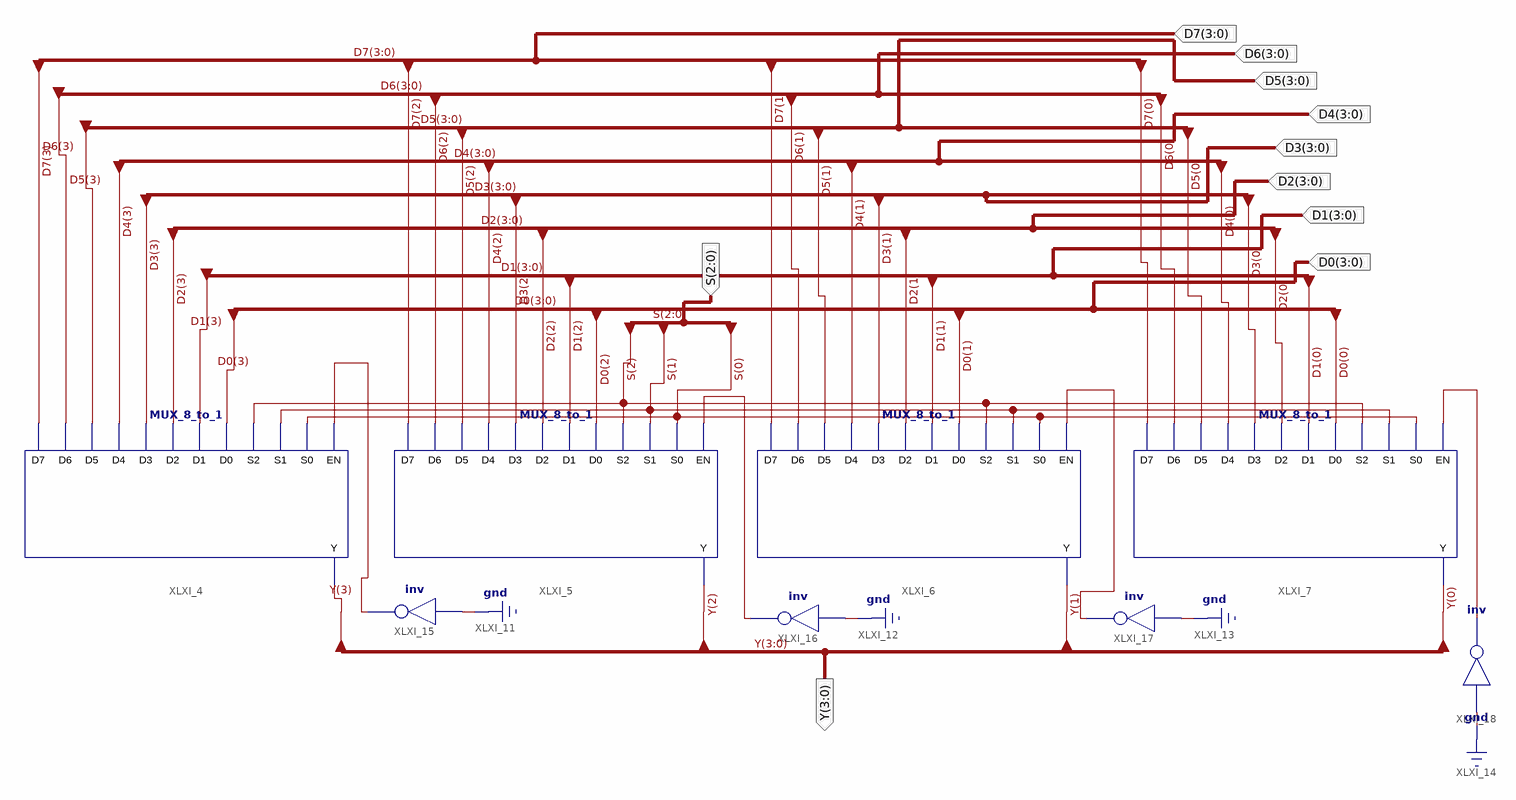
[diagram p0: schematic sheet 1]
// Xilinx ISE schematic Mux_8Way_4Bit.sch (spartan3e) as structural Verilog: 8 symbols, 10 ports
module Mux_8Way_4Bit (
  input  [3:0] D0,
  input  [3:0] D2,
  input  [3:0] D3,
  input  [3:0] D4,
  input  [3:0] D1,
  input  [3:0] D5,
  input  [3:0] D6,
  input  [3:0] D7,
  input  [2:0] S,
  output [3:0] Y
);

  wire XLXN_93, XLXN_94, XLXN_95, XLXN_96;

  MUX_8_to_1 XLXI_6 (
    .D0(D0[1]), .D1(D1[1]), .D2(D2[1]), .D3(D3[1]), .D4(D4[1]), .D5(D5[1]), .D6(D6[1]), .D7(D7[1]),
    .EN(XLXN_94), .S0(S[0]), .S1(S[1]), .S2(S[2]), .Y(Y[1]));
  MUX_8_to_1 XLXI_7 (
    .D0(D0[0]), .D1(D1[0]), .D2(D2[0]), .D3(D3[0]), .D4(D4[0]), .D5(D5[0]), .D6(D6[0]), .D7(D7[0]),
    .EN(XLXN_93), .S0(S[0]), .S1(S[1]), .S2(S[2]), .Y(Y[0]));
  MUX_8_to_1 XLXI_5 (
    .D0(D0[2]), .D1(D1[2]), .D2(D2[2]), .D3(D3[2]), .D4(D4[2]), .D5(D5[2]), .D6(D6[2]), .D7(D7[2]),
    .EN(XLXN_95), .S0(S[0]), .S1(S[1]), .S2(S[2]), .Y(Y[2]));
  MUX_8_to_1 XLXI_4 (
    .D0(D0[3]), .D1(D1[3]), .D2(D2[3]), .D3(D3[3]), .D4(D4[3]), .D5(D5[3]), .D6(D6[3]), .D7(D7[3]),
    .EN(XLXN_96), .S0(S[0]), .S1(S[1]), .S2(S[2]), .Y(Y[3]));
  not XLXI_15 (XLXN_96, 1'b0);
  not XLXI_16 (XLXN_95, 1'b0);
  not XLXI_17 (XLXN_94, 1'b0);
  not XLXI_18 (XLXN_93, 1'b0);
endmodule
